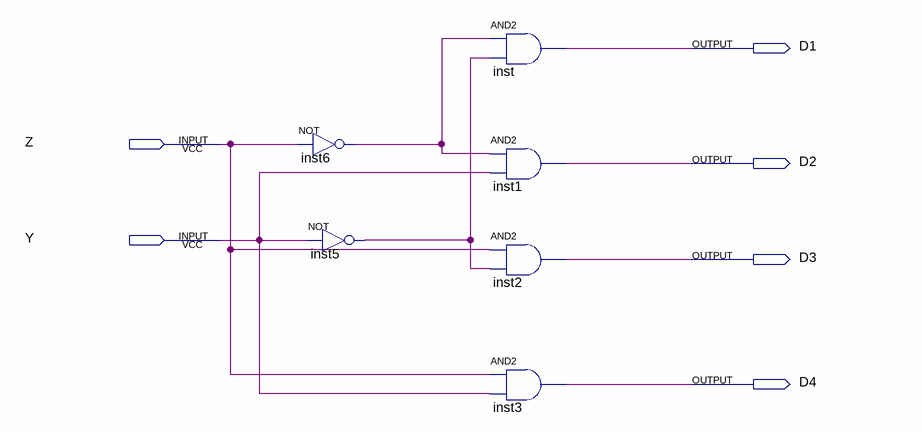
[diagram p0: schematic sheet]
// Quartus schematic dec2.bdf as structural Verilog: 6 symbols, 6 pins
module dec2 (
  input  Z,
  input  Y,
  output D1,
  output D2,
  output D3,
  output D4
);

  wire inst5_out, inst6_out;

  not inst6 (inst6_out, Z);
  not inst5 (inst5_out, Y);
  and inst (D1, inst6_out, inst5_out);
  and inst1 (D2, inst6_out, Y);
  and inst2 (D3, Z, inst5_out);
  and inst3 (D4, Z, Y);
endmodule
